# EasyEDA Pro project stm32-motordrive.epro, schematic Schematic2
Create Date: 2024-04-02; Page Name: P1; Project Name: stm32-motordrive; Schematic Name: Schematic2; Update Date: 2024-04-02; Company: 嘉立创EDA; Page Size: A4; Version: V1.0
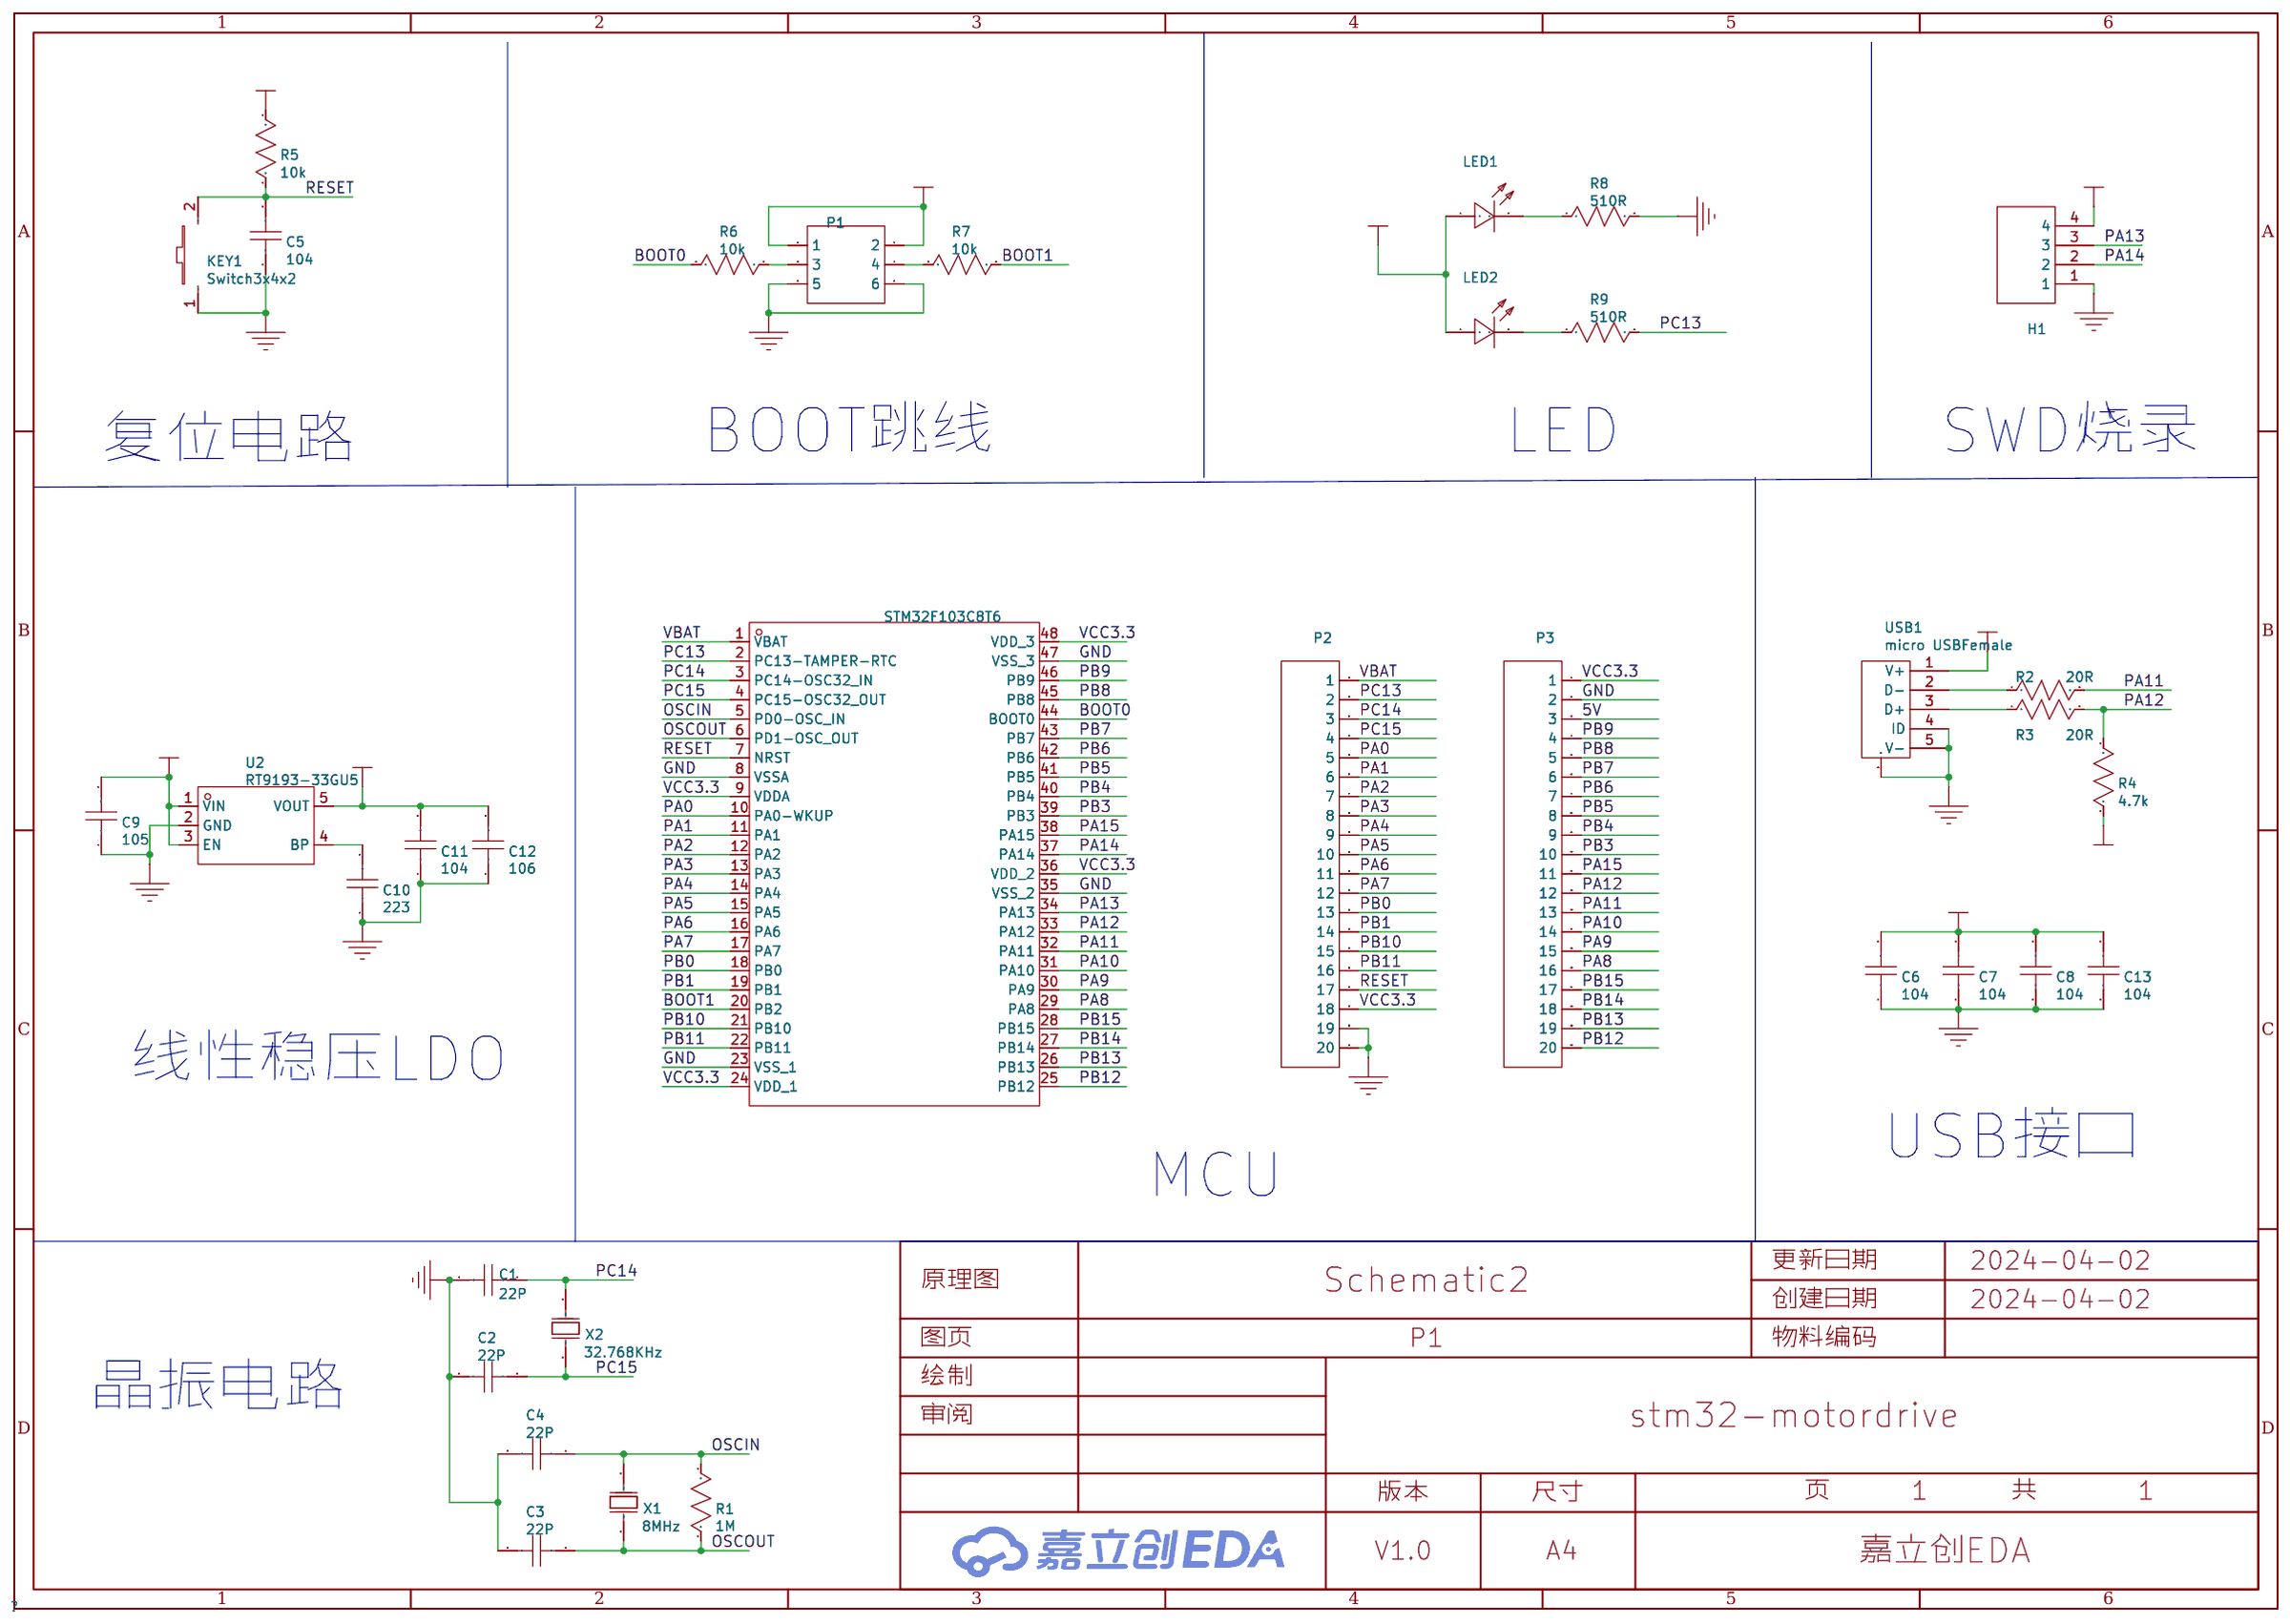
[diagram p3: schematic sheet]

## Parts
C1  22P  [C0603]
C2  22P  [C0603]
C3  22P  [C0603]
C4  22P  [C0603]
C5  104  [C0603]
C6  104  [C0603]
C7  104  [C0603]
C8  104  [C0603]
C9  105  [C0603]
C10  223  [C0603]
C11  104  [C0603]
C12  106  [C0603]
C13  104  [C0603]
H1  220S-1*4P H=8.5MM Ytype Gold-plated  [DIP-1X4P2.54]
KEY1  Switch3x4x2  [KEY-3.0*4.0]
LED1  204-10SURD/S530-A3  [LED0805-RD]
LED2  204-10SURD/S530-A3  [LED0805-RD]
P1  HDR-IDC-2.54-2X3P  [HEADER_PRG_2X3]
P2  Header-Female-2.54_1x20  [HDR-TH_20P-P2.54-V]
P3  Header-Female-2.54_1x20  [HDR-TH_20P-P2.54-V]
R1  1M  [R0603]
R2  20R  [R0603]
R3  20R  [R0603]
R4  4.7k  [R0603]
R5  10k  [R0603]
R6  10k  [R0603]
R7  10k  [R0603]
R8  510R  [R0603]
R9  510R  [R0603]
U1  STM32F103C8T6  [LQFP-48_L7.0-W7.0-P0.50-LS9.0-BL]
U2  RT9193-33GU5  [SC-70-5_L2.1-W1.3-P0.65-LS2.1-BL]
USB1  micro USBFemale  [MICRO-USB-SMD_5P-P0.65-H-F_C10418]
X1  8MHz  [HC-49-SMD_L7.0-W3.0]
X2  32.768KHz  [CRYSTAL_SMD_SEIKOEPSON_MC156-4PIN_7.1X2.5MM]

## Library data of the parts
C1-C4 = 22P
C5-C8 C11 C13 = 104
C9 = 105
C10 = 223
C12 = 106
H1 = 220S-1*4P H=8.5MM Ytype Gold-plated: Supplier: LCSC; Manufacturer: Ckmtw; Supplier Part: C124413
KEY1 = Switch3x4x2: Supplier: LCSC; Manufacturer: ReliaPro; Supplier Part: C26638
LED1 LED2 = 204-10SURD/S530-A3: Supplier: LCSC; Manufacturer: EVERLIGHT; Supplier Part: C99772
P1 = HDR-IDC-2.54-2X3P: Supplier: LCSC; Manufacturer: BOOMELE; Manufacturer Part: 2X3 2.54mm IDC Box; image: //image.lceda.cn/szlcsc/C11214.jpg; Supplier Part: C11214
P2 P3 = Header-Female-2.54_1x20: Supplier: LCSC; Manufacturer: BOOMELE; Manufacturer Part: 2.54mm 1*20P Female header; Supplier Part: C50984
R1 = 1M
R2 R3 = 20R
R4 = 4.7k
R5-R7 = 10k
R8 R9 = 510R
U1 = STM32F103C8T6: Supplier: LCSC; Manufacturer: STMicroelectronics; image: //image.lceda.cn/szlcsc/C8734.jpg; Supplier Part: C8734; JLCPCB Part Class: Basic
U2 = RT9193-33GU5: Supplier: LCSC; Supplier Part: C425797; Manufacturer: Richtek Tech
USB1 = micro USBFemale: Supplier: LCSC; Manufacturer: ValuePro; image: //image.lceda.cn/szlcsc/C10418.jpg; Supplier Part: C10418
X1 = 8MHz: Supplier: LCSC; Manufacturer: YXC; Manufacturer Part: X49SD304MSD2SC; Supplier Part: C52061
X2 = 32.768KHz: Supplier: LCSC; Manufacturer: YXC; Manufacturer Part: X49SD304MSD2SC; Supplier Part: C52061

## Nets
5V: C9.2 P3.3 R4.1 U2.1(VIN) U2.3(EN) USB1.1(V+)
GND: C1.2 C2.2 C3.2 C4.2 C5.1 C6.1 C7.1 C8.1 C9.1 C10.1 C11.1 C12.1 C13.1 H1.1 KEY1.1 P1.5 P1.6 P2.19 P2.20 P3.2 R8.2 U1.8(VSSA) U1.23(VSS_1) U1.35(VSS_2) U1.47(VSS_3) U2.2(GND) USB1.0(MTN) USB1.4(ID) USB1.5(V-)
VBAT: P2.1 U1.1(VBAT)
VCC3.3: C6.2 C7.2 C8.2 C11.2 C12.2 C13.2 H1.4 LED1.1(A) LED2.1(A) P1.1 P1.2 P2.18 P3.1 R5.2 U1.9(VDDA) U1.24(VDD_1) U1.36(VDD_2) U1.48(VDD_3) U2.5(VOUT)
BOOT0: R6.2 U1.44(BOOT0)
BOOT1: R7.1 U1.20(PB2)
OSCIN: C4.1 R1.2 U1.5(PD0-OSC_IN) X1.1(OSC1)
OSCOUT: C3.1 R1.1 U1.6(PD1-OSC_OUT) X1.2(OSC2)
PA0: P2.5 U1.10(PA0-WKUP)
PA1: P2.6 U1.11(PA1)
PA2: P2.7 U1.12(PA2)
PA3: P2.8 U1.13(PA3)
PA4: P2.9 U1.14(PA4)
PA5: P2.10 U1.15(PA5)
PA6: P2.11 U1.16(PA6)
PA7: P2.12 U1.17(PA7)
PA8: P3.16 U1.29(PA8)
PA9: P3.15 U1.30(PA9)
PA10: P3.14 U1.31(PA10)
PA11: P3.13 R2.2 U1.32(PA11)
PA12: P3.12 R3.2 R4.2 U1.33(PA12)
PA13: H1.3 U1.34(PA13)
PA14: H1.2 U1.37(PA14)
PA15: P3.11 U1.38(PA15)
PB0: P2.13 U1.18(PB0)
PB1: P2.14 U1.19(PB1)
PB3: P3.10 U1.39(PB3)
PB4: P3.9 U1.40(PB4)
PB5: P3.8 U1.41(PB5)
PB6: P3.7 U1.42(PB6)
PB7: P3.6 U1.43(PB7)
PB8: P3.5 U1.45(PB8)
PB9: P3.4 U1.46(PB9)
PB10: P2.15 U1.21(PB10)
PB11: P2.16 U1.22(PB11)
PB12: P3.20 U1.25(PB12)
PB13: P3.19 U1.26(PB13)
PB14: P3.18 U1.27(PB14)
PB15: P3.17 U1.28(PB15)
PC13: P2.2 R9.2 U1.2(PC13-TAMPER-RTC)
PC14: C1.1 P2.3 U1.3(PC14-OSC32_IN) X2.1(OSC1)
PC15: C2.1 P2.4 U1.4(PC15-OSC32_OUT) X2.2(OSC2)
RESET: C5.2 KEY1.2 P2.17 R5.1 U1.7(NRST)
LED1_2: LED1.2(K) R8.1
LED2_2: LED2.2(K) R9.1
P1_3: P1.3 R6.1
P1_4: P1.4 R7.2
U2_4: C10.2 U2.4(BP)
USB1_2: R2.1 USB1.2(D-)
USB1_3: R3.1 USB1.3(D+)

## Notes on the sheet
- BOOT跳线
- LED
- SWD烧录
- 复位电路
- 线性稳压LDO
- USB接口
- MCU
- 晶振电路
